# Altium project 51.PrjPCB
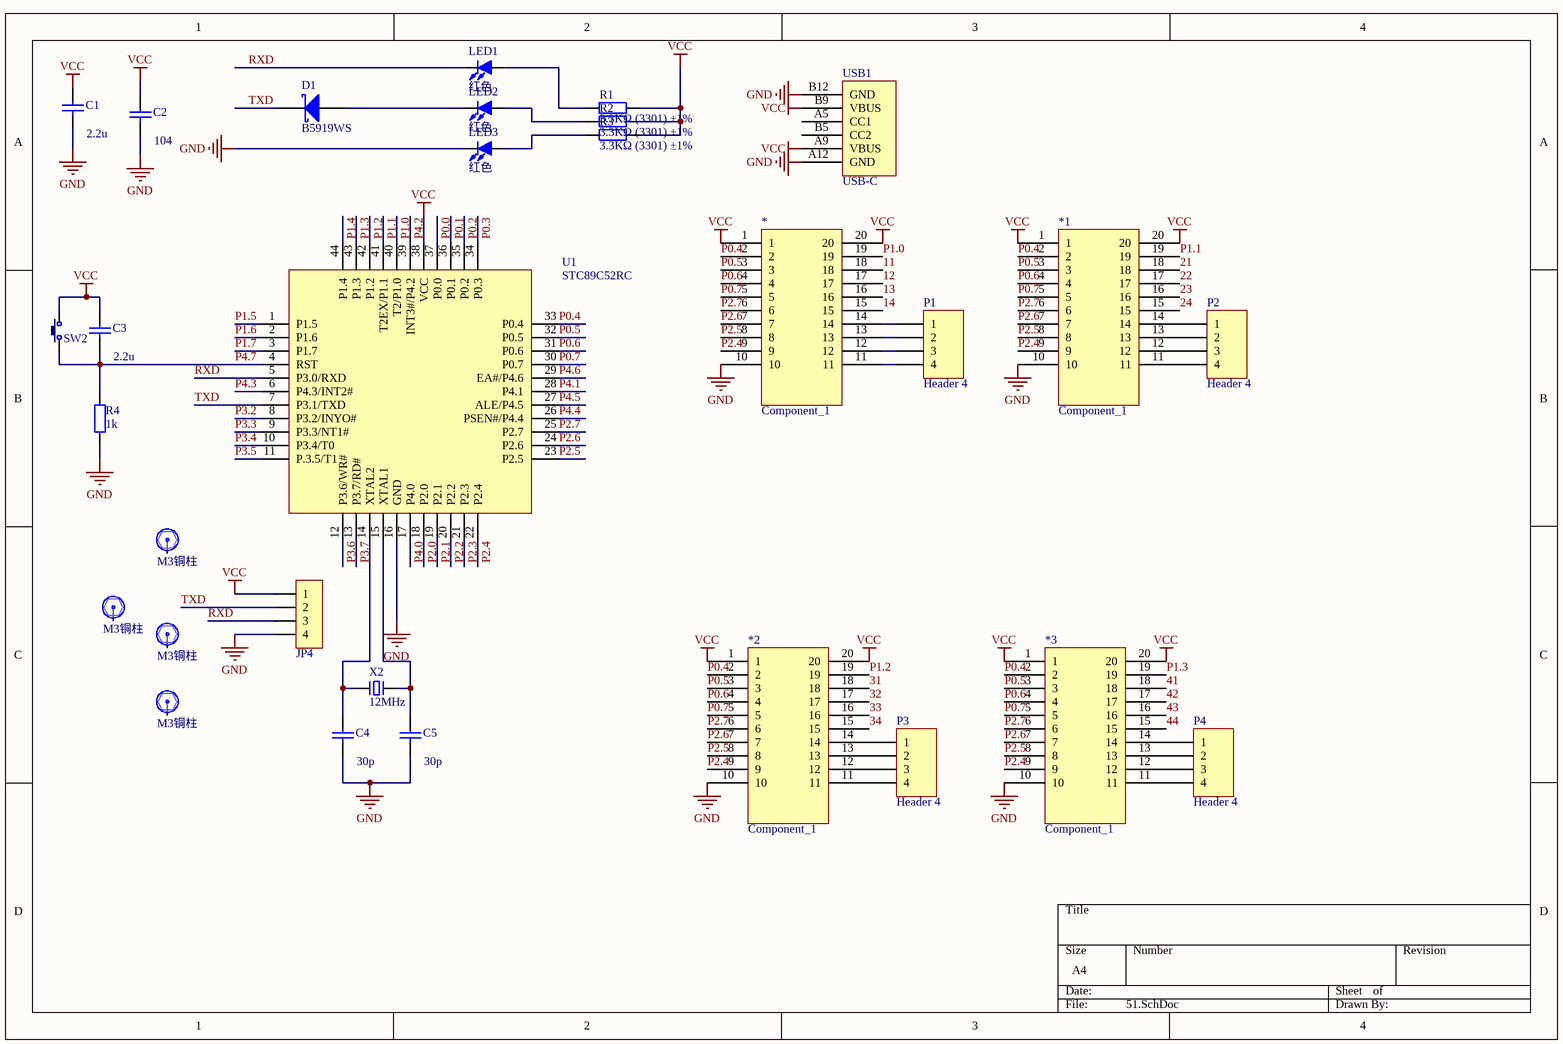
[diagram p0: 51.SchDoc]
1 sheet, 30 parts. Net scope: global (net labels, ports and power ports of the same name join across sheets).
Board file: 51.PcbDoc

## Sheet 51.SchDoc
size A4

### Parts
(Parts that share a designator on the sheet are numbered #1, #2 ... from top to bottom, then left to right.)
*  Component_1  [SOP20_N]
*1  Component_1  [SOP20_N]
*2  Component_1  [SOP20_N]
*3  Component_1  [SOP20_N]
?#1  M3铜柱  [M3x4_L]
?#2  M3铜柱  [M3x4_L]
?#3  M3铜柱  [M3x4_L]
?#4  M3铜柱  [M3x4_L]
C1  2.2u  [0603_C]
C2  104  [0603_C]
C3  2.2u  [0603_C]
C4  30p  [0603_C]
C5  30p  [0603_C]
D1  B5919WS  [SMA]
JP4  HDR-1X4  [HDR2.54-LI-4P]  (value not drawn)
LED1  红色  [LED 0603R]
LED2  红色  [LED 0603R]
LED3  红色  [LED 0603R]
P1  Header 4  [HDR1X4]
P2  Header 4  [HDR1X4]
P3  Header 4  [HDR1X4]
P4  Header 4  [HDR1X4]
R1  3.3KΩ (3301) ±1%  [0805_R]
R2  3.3KΩ (3301) ±1%  [0805_R]
R3  3.3KΩ (3301) ±1%  [0805_R]
R4  1k  [0805_R]
SW2  3x6x5  [TSW DIP-3*6*5]  (value not drawn)
U1  STC89C52RC  [TQFP44 10x10_M]
USB1  USB-C  [USB-C/S_C]
X2  12MHz  [OSC HC-49S]

### Nets
GND: *.10 *1.10 *2.10 *3.10 C1.1 C2.1 C4.1 C5.1 JP4.4 LED3.2(K) R4.1 U1.16(GND) USB1.A12(GND) USB1.B12(GND)
VCC: *.1 *.20 *1.1 *1.20 *2.1 *2.20 *3.1 *3.20 C1.2 C2.2 C3.2 JP4.1 R1.2 R2.2 R3.2 SW2.2 U1.38(VCC) USB1.A9(VBUS) USB1.B9(VBUS)
11: *.18
12: *.17
13: *.16
14: *.15
21: *1.18
22: *1.17
23: *1.16
24: *1.15
31: *2.18
32: *2.17
33: *2.16
34: *2.15
41: *3.18
42: *3.17
43: *3.16
44: *3.15
P0.0: U1.37(P0.0)
P0.1: U1.36(P0.1)
P0.2: U1.35(P0.2)
P0.3: U1.34(P0.3)
P0.4: *.2 *1.2 *2.2 *3.2 U1.33(P0.4)
P0.5: *.3 *1.3 *2.3 *3.3 U1.32(P0.5)
P0.6: *.4 *1.4 *2.4 *3.4 U1.31(P0.6)
P0.7: *.5 *1.5 *2.5 *3.5 U1.30(P0.7)
P1.0: *.19 U1.40(T2/P1.0)
P1.1: *1.19 U1.41(T2EX/P1.1)
P1.2: *2.19 U1.42(P1.2)
P1.3: *3.19 U1.43(P1.3)
P1.4: U1.44(P1.4)
P1.5: U1.1(P1.5)
P1.6: U1.2(P1.6)
P1.7: U1.3(P1.7)
P2.0: U1.18(P2.0)
P2.1: U1.19(P2.1)
P2.2: U1.20(P2.2)
P2.3: U1.21(P2.3)
P2.4: *.9 *1.9 *2.9 *3.9 U1.22(P2.4)
P2.5: *.8 *1.8 *2.8 *3.8 U1.23(P2.5)
P2.6: *.7 *1.7 *2.7 *3.7 U1.24(P2.6)
P2.7: *.6 *1.6 *2.6 *3.6 U1.25(P2.7)
P3.2: U1.8(P3.2/INYO#)
P3.3: U1.9(P3.3/NT1#)
P3.4: U1.10(P3.4/T0)
P3.5: U1.11(P.3.5/T1)
P3.6: U1.12(P3.6/WR#)
P3.7: U1.13(P3.7/RD#)
P4.0: U1.17(P4.0)
P4.1: U1.28(P4.1)
P4.2: U1.39(INT3#/P4.2)
P4.3: U1.6(P4.3/INT2#)
P4.4: U1.26(PSEN#/P4.4)
P4.5: U1.27(ALE/P4.5)
P4.6: U1.29(EA#/P4.6)
P4.7: C3.1 R4.2 SW2.1 U1.4(RST)
RXD: JP4.3 LED1.2(K) U1.5(P3.0/RXD)
TXD: D1.2(K) JP4.2 U1.7(P3.1/TXD)
Net*1_11: *1.11 P2.4
Net*1_12: *1.12 P2.3
Net*1_13: *1.13 P2.2
Net*1_14: *1.14 P2.1
Net*2_11: *2.11 P3.4
Net*2_12: *2.12 P3.3
Net*2_13: *2.13 P3.2
Net*2_14: *2.14 P3.1
Net*3_11: *3.11 P4.4
Net*3_12: *3.12 P4.3
Net*3_13: *3.13 P4.2
Net*3_14: *3.14 P4.1
Net*_11: *.11 P1.4
Net*_12: *.12 P1.3
Net*_13: *.13 P1.2
Net*_14: *.14 P1.1
NetC4_2: C4.2 U1.14(XTAL2) X2.1
NetC5_2: C5.2 U1.15(XTAL1) X2.2
NetD1_1: D1.1(A) LED2.2(K)
NetLED1_1: LED1.1(A) R1.1
NetLED2_1: LED2.1(A) R2.1
NetLED3_1: LED3.1(A) R3.1

Not connected (* = marked no-connect by the designer): ?#1 1; ?#2 1; ?#3 1; ?#4 1; USB1 A5(CC1) B5(CC2)

### Library data of the parts
?#1-?#4 = 铜柱大焊盘: 铜柱; 版权归属: 封装库来自淘宝 ID：黄晶宝石; BOM名称: 铜柱; 学习资源: https://shop463601444.taobao.com
C1-C5 = 0603 1uF (105) 10% 50V: 贴片电容; ComponentLink1Description: 供应商链接; ComponentLink1URL: http://www.szlcsc.com/product/details_16531.html; Package: 0603; Supplier: LC; SuppliersPartNumber: C15849
D1 = 1N5819: 肖特基二极管; 淘宝ID: 封装库来自淘宝 ID：黄晶宝石; 属性: 40V/2A; BOM名称: 肖特基二极管; 欢迎光临: https://shop463601444.taobao.com
JP4 = Header 4: 4P接插件; 版权归属: 封装库来自淘宝 ID：黄晶宝石; BOM名称: 4P接插件; 学习资源: https://shop463601444.taobao.com
LED1-LED3 = LED-SMD: 贴片LED; 版权归属: 封装库来自淘宝 ID：黄晶宝石; BOM名称: 贴片LED; 学习资源: https://shop463601444.taobao.com
P1-P4 = Header 4: Header, 4-Pin; LatestRevisionDate: 17-Jul-2002; LatestRevisionNote: Re-released for DXP Platform.; Publisher: Altium Limited
R1-R4 = 0805 3.3KΩ (3301) 1%: 贴片电阻; ComponentLink1Description: 供应商链接; ComponentLink1URL: http://www.szlcsc.com/product/details_26753.html; Package: 0805; Supplier: LC; SuppliersPartNumber: C26010
SW2 = TSW 3x6: 3x6轻触开关; 版权归属: 封装库来自淘宝 ID：黄晶宝石; BOM名称: 3x6轻触开关; 学习资源: https://shop463601444.taobao.com
U1 = ATmega32U4: STC单片机; BOM名称: AVR单片机; 版权归属: 源创客; 学习资源: www.ooocke.com
USB1 = USB-C_6P/S: USB-C_6P型母接口; BOM名称: USB-C型母接口
X2 = XTAL-2P: 2脚无源脚晶振; 版权归属: 封装库来自淘宝卖家 ID：黄晶宝石; BOM名称: 2脚无源脚晶振; 学习资源: https://shop463601444.taobao.com